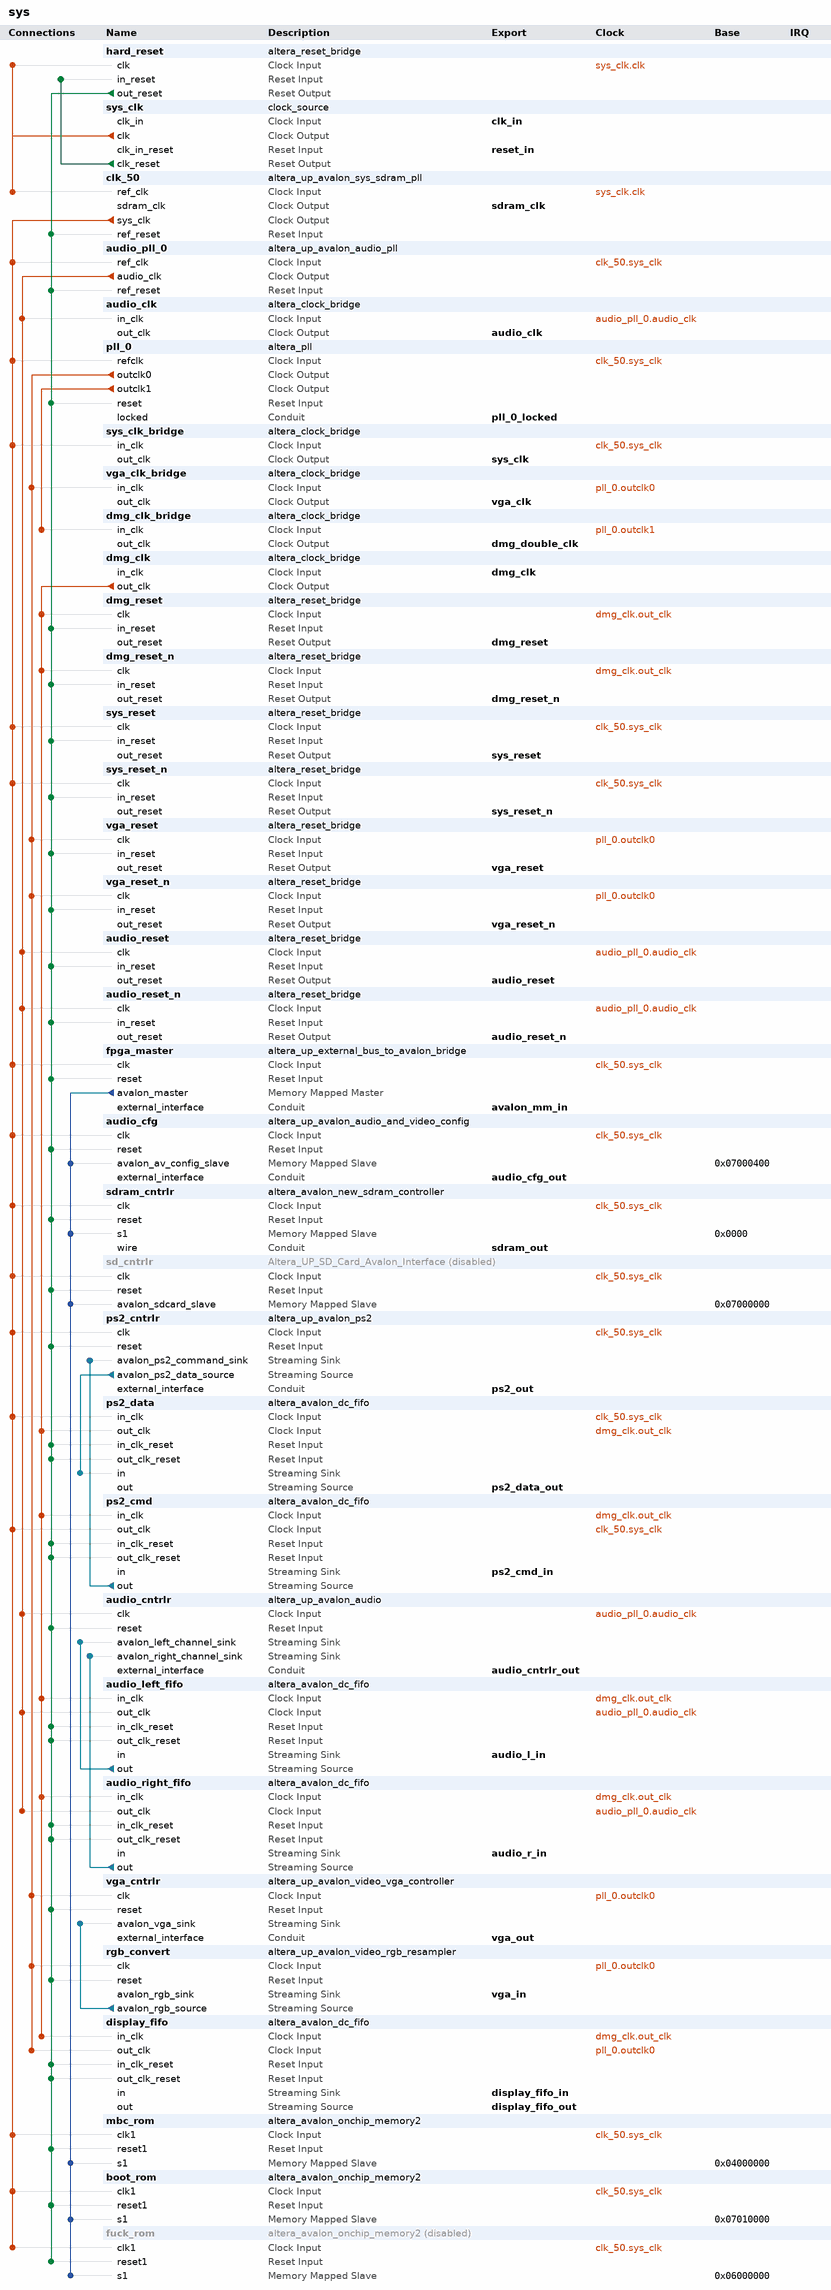
[diagram p0: system contents]
# Platform Designer (Qsys) system sys, Cyclone V 5CSEMA5F31C6
# Parameters at their usual value, and those the tool derives, are not listed.
package require -exact qsys 17.0
create_system sys
set_project_property DEVICE_FAMILY {Cyclone V}
set_project_property DEVICE 5CSEMA5F31C6

add_instance hard_reset altera_reset_bridge 17.0
set_instance_parameter_value hard_reset ACTIVE_LOW_RESET 1
set_instance_parameter_value hard_reset SYNCHRONOUS_EDGES deassert

add_instance sys_clk clock_source 17.0
set_instance_parameter_value sys_clk clockFrequency 50000000
set_instance_parameter_value sys_clk resetSynchronousEdges DEASSERT

add_instance clk_50 altera_up_avalon_sys_sdram_pll 17.0
set_instance_parameter_value clk_50 CV_boards DE1-SoC
set_instance_parameter_value clk_50 gui_outclk 50.0
set_instance_parameter_value clk_50 gui_refclk 50.0

add_instance audio_pll_0 altera_up_avalon_audio_pll 17.0
set_instance_parameter_value audio_pll_0 gui_refclk 50.0

add_instance audio_clk altera_clock_bridge 17.0
set_instance_parameter_value audio_clk DERIVED_CLOCK_RATE 12288135
set_instance_parameter_value audio_clk EXPLICIT_CLOCK_RATE 0

add_instance pll_0 altera_pll 17.0
set_instance_parameter_value pll_0 gui_device_speed_grade 1
set_instance_parameter_value pll_0 gui_number_of_clocks 2
set_instance_parameter_value pll_0 gui_operation_mode direct
set_instance_parameter_value pll_0 gui_output_clock_frequency0 65.0
set_instance_parameter_value pll_0 gui_output_clock_frequency1 8.425925
set_instance_parameter_value pll_0 gui_pll_mode {Integer-N PLL}
set_instance_parameter_value pll_0 gui_reference_clock_frequency 50.0
set_instance_parameter_value pll_0 gui_use_locked true

add_instance sys_clk_bridge altera_clock_bridge 17.0
set_instance_parameter_value sys_clk_bridge DERIVED_CLOCK_RATE 50000000
set_instance_parameter_value sys_clk_bridge EXPLICIT_CLOCK_RATE 0

add_instance vga_clk_bridge altera_clock_bridge 17.0
set_instance_parameter_value vga_clk_bridge DERIVED_CLOCK_RATE 65000000
set_instance_parameter_value vga_clk_bridge EXPLICIT_CLOCK_RATE 0

add_instance dmg_clk_bridge altera_clock_bridge 17.0
set_instance_parameter_value dmg_clk_bridge DERIVED_CLOCK_RATE 8425925
set_instance_parameter_value dmg_clk_bridge EXPLICIT_CLOCK_RATE 0

add_instance dmg_clk altera_clock_bridge 17.0
set_instance_parameter_value dmg_clk DERIVED_CLOCK_RATE 0
set_instance_parameter_value dmg_clk EXPLICIT_CLOCK_RATE 4212962

add_instance dmg_reset altera_reset_bridge 17.0
set_instance_parameter_value dmg_reset ACTIVE_LOW_RESET 0
set_instance_parameter_value dmg_reset SYNCHRONOUS_EDGES deassert

add_instance dmg_reset_n altera_reset_bridge 17.0
set_instance_parameter_value dmg_reset_n ACTIVE_LOW_RESET 1
set_instance_parameter_value dmg_reset_n SYNCHRONOUS_EDGES deassert

add_instance sys_reset altera_reset_bridge 17.0
set_instance_parameter_value sys_reset ACTIVE_LOW_RESET 0
set_instance_parameter_value sys_reset SYNCHRONOUS_EDGES deassert

add_instance sys_reset_n altera_reset_bridge 17.0
set_instance_parameter_value sys_reset_n ACTIVE_LOW_RESET 1
set_instance_parameter_value sys_reset_n SYNCHRONOUS_EDGES deassert

add_instance vga_reset altera_reset_bridge 17.0
set_instance_parameter_value vga_reset ACTIVE_LOW_RESET 0
set_instance_parameter_value vga_reset SYNCHRONOUS_EDGES deassert

add_instance vga_reset_n altera_reset_bridge 17.0
set_instance_parameter_value vga_reset_n ACTIVE_LOW_RESET 1
set_instance_parameter_value vga_reset_n SYNCHRONOUS_EDGES deassert

add_instance audio_reset altera_reset_bridge 17.0
set_instance_parameter_value audio_reset ACTIVE_LOW_RESET 0
set_instance_parameter_value audio_reset SYNCHRONOUS_EDGES deassert

add_instance audio_reset_n altera_reset_bridge 17.0
set_instance_parameter_value audio_reset_n ACTIVE_LOW_RESET 1
set_instance_parameter_value audio_reset_n SYNCHRONOUS_EDGES deassert

add_instance fpga_master altera_up_external_bus_to_avalon_bridge 17.0
set_instance_parameter_value fpga_master addr_size 128
set_instance_parameter_value fpga_master addr_size_multiplier Mbytes
set_instance_parameter_value fpga_master data_size 16

add_instance audio_cfg altera_up_avalon_audio_and_video_config 17.0
set_instance_parameter_value audio_cfg audio_in {Line In to ADC}
set_instance_parameter_value audio_cfg bit_length 16
set_instance_parameter_value audio_cfg board DE1-SoC
set_instance_parameter_value audio_cfg line_in_bypass false
set_instance_parameter_value audio_cfg sampling_rate {48 kHz}

add_instance sdram_cntrlr altera_avalon_new_sdram_controller 17.0
set_instance_parameter_value sdram_cntrlr TAC 5.4
set_instance_parameter_value sdram_cntrlr TRCD 15.0
set_instance_parameter_value sdram_cntrlr TRP 15.0
set_instance_parameter_value sdram_cntrlr casLatency 3
set_instance_parameter_value sdram_cntrlr columnWidth 10
set_instance_parameter_value sdram_cntrlr dataWidth 16
set_instance_parameter_value sdram_cntrlr generateSimulationModel true
set_instance_parameter_value sdram_cntrlr model single_Micron_MT48LC4M32B2_7_chip
set_instance_parameter_value sdram_cntrlr numberOfBanks 4
set_instance_parameter_value sdram_cntrlr numberOfChipSelects 1
set_instance_parameter_value sdram_cntrlr powerUpDelay 100.0
set_instance_parameter_value sdram_cntrlr refreshPeriod 7.8125
set_instance_parameter_value sdram_cntrlr rowWidth 13

add_instance sd_cntrlr Altera_UP_SD_Card_Avalon_Interface 17.0
set_instance_property sd_cntrlr ENABLED false

add_instance ps2_cntrlr altera_up_avalon_ps2 17.0
set_instance_parameter_value ps2_cntrlr avalon_bus_type Streaming

add_instance ps2_data altera_avalon_dc_fifo 17.0
set_instance_parameter_value ps2_data BITS_PER_SYMBOL 8
set_instance_parameter_value ps2_data FIFO_DEPTH 4
set_instance_parameter_value ps2_data USE_PACKETS 0

add_instance ps2_cmd altera_avalon_dc_fifo 17.0
set_instance_parameter_value ps2_cmd BITS_PER_SYMBOL 8
set_instance_parameter_value ps2_cmd FIFO_DEPTH 8
set_instance_parameter_value ps2_cmd USE_PACKETS 0

add_instance audio_cntrlr altera_up_avalon_audio 17.0
set_instance_parameter_value audio_cntrlr audio_in false
set_instance_parameter_value audio_cntrlr avalon_bus_type Streaming
set_instance_parameter_value audio_cntrlr dw 16

add_instance audio_left_fifo altera_avalon_dc_fifo 17.0
set_instance_parameter_value audio_left_fifo BITS_PER_SYMBOL 8
set_instance_parameter_value audio_left_fifo FIFO_DEPTH 4
set_instance_parameter_value audio_left_fifo SYMBOLS_PER_BEAT 2
set_instance_parameter_value audio_left_fifo USE_PACKETS 0

add_instance audio_right_fifo altera_avalon_dc_fifo 17.0
set_instance_parameter_value audio_right_fifo BITS_PER_SYMBOL 8
set_instance_parameter_value audio_right_fifo FIFO_DEPTH 4
set_instance_parameter_value audio_right_fifo SYMBOLS_PER_BEAT 2
set_instance_parameter_value audio_right_fifo USE_PACKETS 0

add_instance vga_cntrlr altera_up_avalon_video_vga_controller 17.0
set_instance_parameter_value vga_cntrlr board DE1-SoC
set_instance_parameter_value vga_cntrlr resolution {XGA 1024x768}

add_instance rgb_convert altera_up_avalon_video_rgb_resampler 17.0
set_instance_parameter_value rgb_convert alpha 1023
set_instance_parameter_value rgb_convert input_type {24-bit RGB}
set_instance_parameter_value rgb_convert output_type {30-bit RGB}

add_instance display_fifo altera_avalon_dc_fifo 17.0
set_instance_parameter_value display_fifo BITS_PER_SYMBOL 32
set_instance_parameter_value display_fifo FIFO_DEPTH 4
set_instance_parameter_value display_fifo SYMBOLS_PER_BEAT 10
set_instance_parameter_value display_fifo USE_PACKETS 0

add_instance mbc_rom altera_avalon_onchip_memory2 17.0
set_instance_parameter_value mbc_rom dataWidth 16
set_instance_parameter_value mbc_rom dualPort false
set_instance_parameter_value mbc_rom initMemContent true
set_instance_parameter_value mbc_rom initializationFileName roms/sml_rom.hex
set_instance_parameter_value mbc_rom memorySize 65536
set_instance_parameter_value mbc_rom resetrequest_enabled false
set_instance_parameter_value mbc_rom useNonDefaultInitFile true
set_instance_parameter_value mbc_rom writable false

add_instance boot_rom altera_avalon_onchip_memory2 17.0
set_instance_parameter_value boot_rom dataWidth 16
set_instance_parameter_value boot_rom dualPort false
set_instance_parameter_value boot_rom initMemContent true
set_instance_parameter_value boot_rom initializationFileName roms/dmg_bootrom.hex
set_instance_parameter_value boot_rom memorySize 256
set_instance_parameter_value boot_rom resetrequest_enabled false
set_instance_parameter_value boot_rom useNonDefaultInitFile true
set_instance_parameter_value boot_rom writable false

add_instance fuck_rom altera_avalon_onchip_memory2 17.0
set_instance_property fuck_rom ENABLED false
set_instance_parameter_value fuck_rom dataWidth 16
set_instance_parameter_value fuck_rom dualPort false
set_instance_parameter_value fuck_rom initMemContent true
set_instance_parameter_value fuck_rom initializationFileName roms/dmg_bootrom.hex
set_instance_parameter_value fuck_rom memorySize 1048576
set_instance_parameter_value fuck_rom resetrequest_enabled false
set_instance_parameter_value fuck_rom useNonDefaultInitFile true
set_instance_parameter_value fuck_rom writable false

# connections
add_connection audio_pll_0.audio_clk audio_clk.in_clk clock
add_connection audio_pll_0.audio_clk audio_cntrlr.clk clock
add_connection audio_pll_0.audio_clk audio_left_fifo.out_clk clock
add_connection audio_pll_0.audio_clk audio_reset.clk clock
add_connection audio_pll_0.audio_clk audio_reset_n.clk clock
add_connection audio_pll_0.audio_clk audio_right_fifo.out_clk clock
add_connection clk_50.sys_clk audio_cfg.clk clock
add_connection clk_50.sys_clk audio_pll_0.ref_clk clock
add_connection clk_50.sys_clk boot_rom.clk1 clock
add_connection clk_50.sys_clk fpga_master.clk clock
add_connection clk_50.sys_clk fuck_rom.clk1 clock
add_connection clk_50.sys_clk mbc_rom.clk1 clock
add_connection clk_50.sys_clk pll_0.refclk clock
add_connection clk_50.sys_clk ps2_cmd.out_clk clock
add_connection clk_50.sys_clk ps2_cntrlr.clk clock
add_connection clk_50.sys_clk ps2_data.in_clk clock
add_connection clk_50.sys_clk sd_cntrlr.clk clock
add_connection clk_50.sys_clk sdram_cntrlr.clk clock
add_connection clk_50.sys_clk sys_clk_bridge.in_clk clock
add_connection clk_50.sys_clk sys_reset.clk clock
add_connection clk_50.sys_clk sys_reset_n.clk clock
add_connection dmg_clk.out_clk audio_left_fifo.in_clk clock
add_connection dmg_clk.out_clk audio_right_fifo.in_clk clock
add_connection dmg_clk.out_clk display_fifo.in_clk clock
add_connection dmg_clk.out_clk dmg_reset.clk clock
add_connection dmg_clk.out_clk dmg_reset_n.clk clock
add_connection dmg_clk.out_clk ps2_cmd.in_clk clock
add_connection dmg_clk.out_clk ps2_data.out_clk clock
add_connection pll_0.outclk0 display_fifo.out_clk clock
add_connection pll_0.outclk0 rgb_convert.clk clock
add_connection pll_0.outclk0 vga_clk_bridge.in_clk clock
add_connection pll_0.outclk0 vga_cntrlr.clk clock
add_connection pll_0.outclk0 vga_reset.clk clock
add_connection pll_0.outclk0 vga_reset_n.clk clock
add_connection pll_0.outclk1 dmg_clk_bridge.in_clk clock
add_connection sys_clk.clk clk_50.ref_clk clock
add_connection sys_clk.clk hard_reset.clk clock
add_connection hard_reset.out_reset audio_cfg.reset reset
add_connection hard_reset.out_reset audio_cntrlr.reset reset
add_connection hard_reset.out_reset audio_left_fifo.in_clk_reset reset
add_connection hard_reset.out_reset audio_left_fifo.out_clk_reset reset
add_connection hard_reset.out_reset audio_pll_0.ref_reset reset
add_connection hard_reset.out_reset audio_reset.in_reset reset
add_connection hard_reset.out_reset audio_reset_n.in_reset reset
add_connection hard_reset.out_reset audio_right_fifo.in_clk_reset reset
add_connection hard_reset.out_reset audio_right_fifo.out_clk_reset reset
add_connection hard_reset.out_reset boot_rom.reset1 reset
add_connection hard_reset.out_reset clk_50.ref_reset reset
add_connection hard_reset.out_reset display_fifo.in_clk_reset reset
add_connection hard_reset.out_reset display_fifo.out_clk_reset reset
add_connection hard_reset.out_reset dmg_reset.in_reset reset
add_connection hard_reset.out_reset dmg_reset_n.in_reset reset
add_connection hard_reset.out_reset fpga_master.reset reset
add_connection hard_reset.out_reset fuck_rom.reset1 reset
add_connection hard_reset.out_reset mbc_rom.reset1 reset
add_connection hard_reset.out_reset pll_0.reset reset
add_connection hard_reset.out_reset ps2_cmd.in_clk_reset reset
add_connection hard_reset.out_reset ps2_cmd.out_clk_reset reset
add_connection hard_reset.out_reset ps2_cntrlr.reset reset
add_connection hard_reset.out_reset ps2_data.in_clk_reset reset
add_connection hard_reset.out_reset ps2_data.out_clk_reset reset
add_connection hard_reset.out_reset rgb_convert.reset reset
add_connection hard_reset.out_reset sd_cntrlr.reset reset
add_connection hard_reset.out_reset sdram_cntrlr.reset reset
add_connection hard_reset.out_reset sys_reset.in_reset reset
add_connection hard_reset.out_reset sys_reset_n.in_reset reset
add_connection hard_reset.out_reset vga_cntrlr.reset reset
add_connection hard_reset.out_reset vga_reset.in_reset reset
add_connection hard_reset.out_reset vga_reset_n.in_reset reset
add_connection sys_clk.clk_reset hard_reset.in_reset reset
add_connection fpga_master.avalon_master audio_cfg.avalon_av_config_slave avalon
set_connection_parameter_value fpga_master.avalon_master/audio_cfg.avalon_av_config_slave baseAddress 0x07000400
add_connection fpga_master.avalon_master boot_rom.s1 avalon
set_connection_parameter_value fpga_master.avalon_master/boot_rom.s1 baseAddress 0x07010000
add_connection fpga_master.avalon_master fuck_rom.s1 avalon
set_connection_parameter_value fpga_master.avalon_master/fuck_rom.s1 baseAddress 0x06000000
add_connection fpga_master.avalon_master mbc_rom.s1 avalon
set_connection_parameter_value fpga_master.avalon_master/mbc_rom.s1 baseAddress 0x04000000
add_connection fpga_master.avalon_master sd_cntrlr.avalon_sdcard_slave avalon
set_connection_parameter_value fpga_master.avalon_master/sd_cntrlr.avalon_sdcard_slave baseAddress 0x07000000
add_connection fpga_master.avalon_master sdram_cntrlr.s1 avalon
set_connection_parameter_value fpga_master.avalon_master/sdram_cntrlr.s1 baseAddress 0x0000
add_connection audio_left_fifo.out audio_cntrlr.avalon_left_channel_sink avalon_streaming
add_connection audio_right_fifo.out audio_cntrlr.avalon_right_channel_sink avalon_streaming
add_connection ps2_cmd.out ps2_cntrlr.avalon_ps2_command_sink avalon_streaming
add_connection ps2_cntrlr.avalon_ps2_data_source ps2_data.in avalon_streaming
add_connection rgb_convert.avalon_rgb_source vga_cntrlr.avalon_vga_sink avalon_streaming

# exported interfaces
add_interface audio_cfg_out conduit end
set_interface_property audio_cfg_out EXPORT_OF audio_cfg.external_interface
add_interface audio_clk clock source
set_interface_property audio_clk EXPORT_OF audio_clk.out_clk
add_interface audio_cntrlr_out conduit end
set_interface_property audio_cntrlr_out EXPORT_OF audio_cntrlr.external_interface
add_interface audio_l_in avalon_streaming sink
set_interface_property audio_l_in EXPORT_OF audio_left_fifo.in
add_interface audio_r_in avalon_streaming sink
set_interface_property audio_r_in EXPORT_OF audio_right_fifo.in
add_interface audio_reset reset source
set_interface_property audio_reset EXPORT_OF audio_reset.out_reset
add_interface audio_reset_n reset source
set_interface_property audio_reset_n EXPORT_OF audio_reset_n.out_reset
add_interface avalon_mm_in conduit end
set_interface_property avalon_mm_in EXPORT_OF fpga_master.external_interface
add_interface clk_in clock sink
set_interface_property clk_in EXPORT_OF sys_clk.clk_in
add_interface display_fifo_in avalon_streaming sink
set_interface_property display_fifo_in EXPORT_OF display_fifo.in
add_interface display_fifo_out avalon_streaming source
set_interface_property display_fifo_out EXPORT_OF display_fifo.out
add_interface dmg_clk clock sink
set_interface_property dmg_clk EXPORT_OF dmg_clk.in_clk
add_interface dmg_double_clk clock source
set_interface_property dmg_double_clk EXPORT_OF dmg_clk_bridge.out_clk
add_interface dmg_reset reset source
set_interface_property dmg_reset EXPORT_OF dmg_reset.out_reset
add_interface dmg_reset_n reset source
set_interface_property dmg_reset_n EXPORT_OF dmg_reset_n.out_reset
add_interface pll_0_locked conduit end
set_interface_property pll_0_locked EXPORT_OF pll_0.locked
add_interface ps2_cmd_in avalon_streaming sink
set_interface_property ps2_cmd_in EXPORT_OF ps2_cmd.in
add_interface ps2_data_out avalon_streaming source
set_interface_property ps2_data_out EXPORT_OF ps2_data.out
add_interface ps2_out conduit end
set_interface_property ps2_out EXPORT_OF ps2_cntrlr.external_interface
add_interface reset_in reset sink
set_interface_property reset_in EXPORT_OF sys_clk.clk_in_reset
add_interface sdram_clk clock source
set_interface_property sdram_clk EXPORT_OF clk_50.sdram_clk
add_interface sdram_out conduit end
set_interface_property sdram_out EXPORT_OF sdram_cntrlr.wire
add_interface sys_clk clock source
set_interface_property sys_clk EXPORT_OF sys_clk_bridge.out_clk
add_interface sys_reset reset source
set_interface_property sys_reset EXPORT_OF sys_reset.out_reset
add_interface sys_reset_n reset source
set_interface_property sys_reset_n EXPORT_OF sys_reset_n.out_reset
add_interface vga_clk clock source
set_interface_property vga_clk EXPORT_OF vga_clk_bridge.out_clk
add_interface vga_in avalon_streaming sink
set_interface_property vga_in EXPORT_OF rgb_convert.avalon_rgb_sink
add_interface vga_out conduit end
set_interface_property vga_out EXPORT_OF vga_cntrlr.external_interface
add_interface vga_reset reset source
set_interface_property vga_reset EXPORT_OF vga_reset.out_reset
add_interface vga_reset_n reset source
set_interface_property vga_reset_n EXPORT_OF vga_reset_n.out_reset

set_interconnect_requirement {$system} qsys_mm.clockCrossingAdapter AUTO
set_interconnect_requirement {$system} qsys_mm.enableEccProtection FALSE
set_interconnect_requirement {$system} qsys_mm.insertDefaultSlave FALSE
set_interconnect_requirement {$system} qsys_mm.maxAdditionalLatency 1

save_system sys.qsys
